# EAGLE design GimbalMotorController2017 (EAGLE 8.3.2)
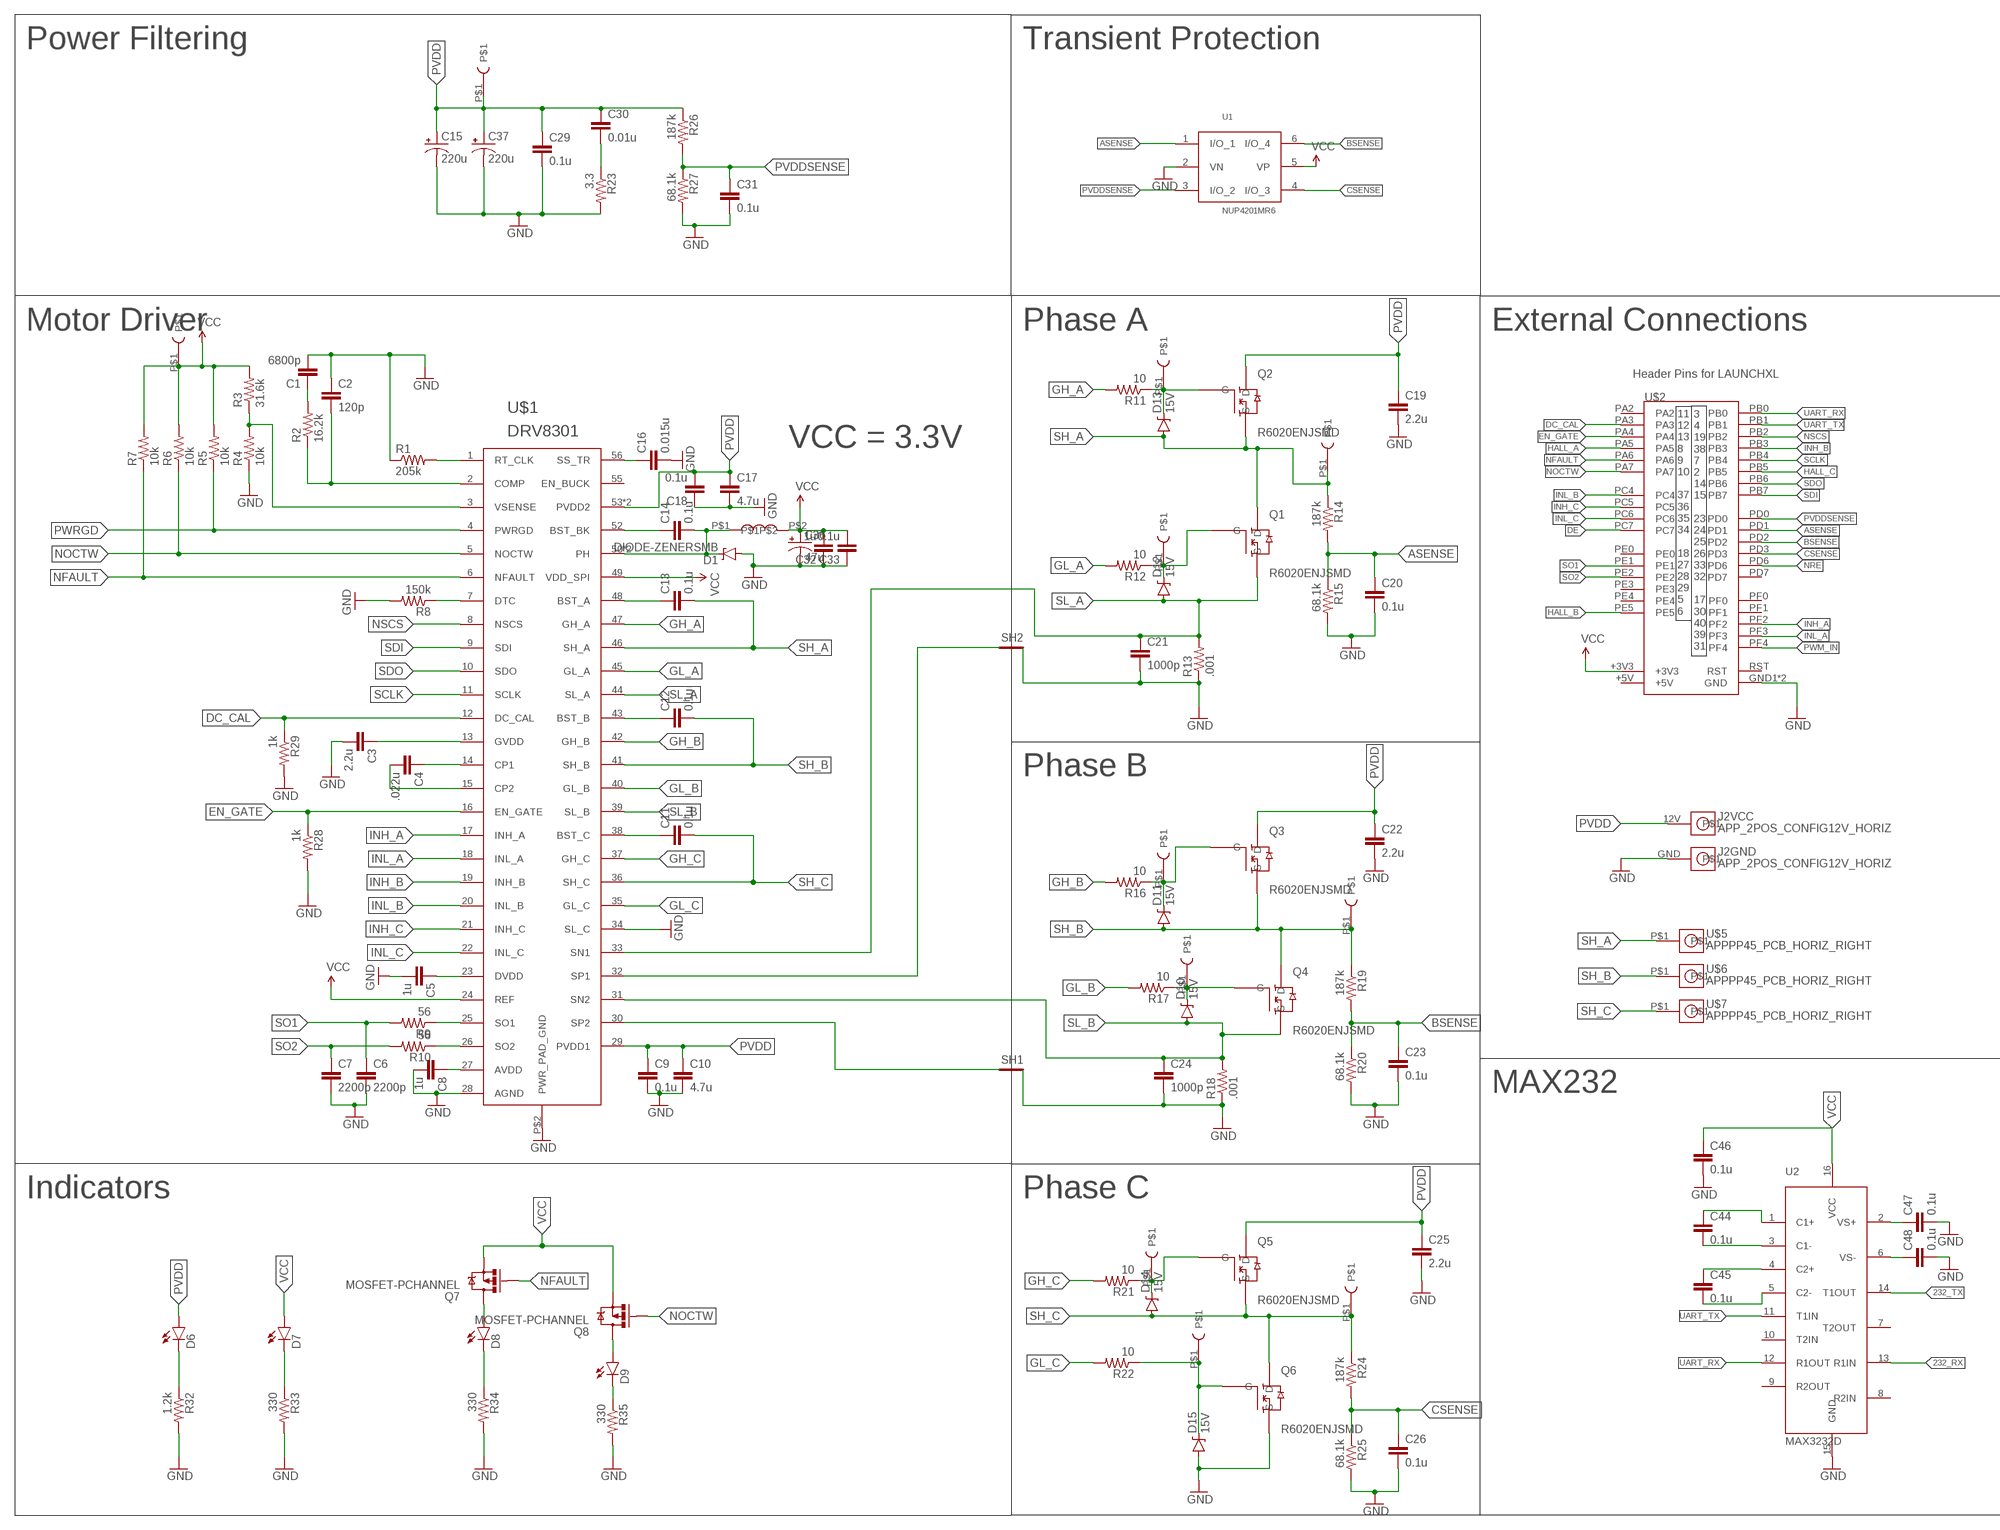
[diagram p0: schematic, sheet 1, part 1 of 2]
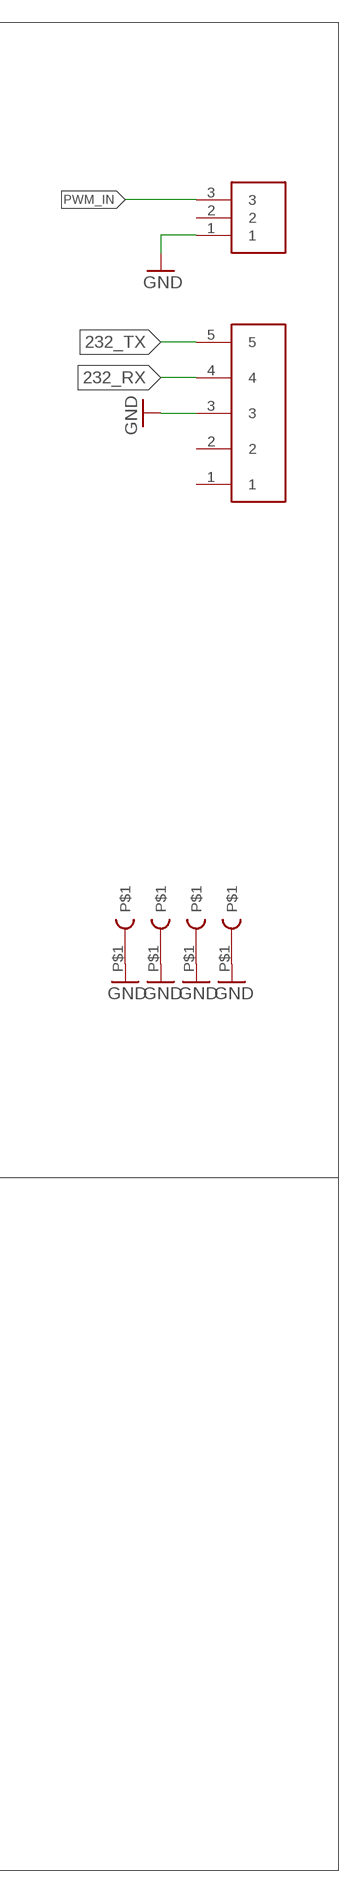
[diagram p1: schematic, sheet 1, part 2 of 2]

## Parts
C1  6800p  CAP0805  [0805]
C2  120p  CAP0805  [0805]
C3  2.2u  CAP1206  [1206]
C4  .022u  CAP0805  [0805]
C5  1u  CAP0805  [0805]
C6  2200p  CAP0805  [0805]
C7  2200p  CAP0805  [0805]
C8  1u  CAP0805  [0805]
C9  0.1u  CAP0805  [0805]
C10  4.7u  CAP1206  [1206]
C11  0.1u  CAP0805  [0805]
C12  0.1u  CAP0805  [0805]
C13  0.1u  CAP0805  [0805]
C14  0.1u  CAP0805  [0805]
C15  220u  CAP_POLPTH4  [CPOL-RADIAL-1000UF-25V]
C16  0.015u  CAP0805  [0805]
C17  4.7u  CAP1206  [1206]
C18  0.1u  CAP0805  [0805]
C19  2.2u  CAP1206  [1206]
C20  0.1u  CAP0805  [0805]
C21  1000p  CAP0805  [0805]
C22  2.2u  CAP1206  [1206]
C23  0.1u  CAP0805  [0805]
C24  1000p  CAP0805  [0805]
C25  2.2u  CAP1206  [1206]
C26  0.1u  CAP0805  [0805]
C29  0.1u  CAP0805  [0805]
C30  0.01u  CAP0805  [0805]
C31  0.1u  CAP0805  [0805]
C32  1u  CAP0805  [0805]
C33  0.1u  CAP0805  [0805]
C36  47u  CAP_POLPTH1  [CPOL-RADIAL-100UF-25V]
C37  220u  CAP_POLPTH4  [CPOL-RADIAL-1000UF-25V]
C44  0.1u  CAP0805  [0805]
C45  0.1u  CAP0805  [0805]
C46  0.1u  CAP0805  [0805]
C47  0.1u  CAP0805  [0805]
C48  0.1u  CAP0805  [0805]
D1  DIODE-ZENERSMB  [SMB-DIODE]
D6  LED1206  [LED-1206]
D7  LED1206  [LED-1206]
D8  LED1206  [LED-1206]
D9  LED1206  [LED-1206]
D10  15V  DIODE-ZENER3.3V  [SOD-323]
D11  15V  DIODE-ZENER3.3V  [SOD-323]
D12  15V  DIODE-ZENER3.3V  [SOD-323]
D13  15V  DIODE-ZENER3.3V  [SOD-323]
D14  15V  DIODE-ZENER3.3V  [SOD-323]
D15  15V  DIODE-ZENER3.3V  [SOD-323]
J1  SL03THROUGH_HOLE  [MOLEX_SL_03_TH]
J2  APP_2POS_CONFIG12V_HORIZ  [APP45_12V_HORIZ_CONFIG]
Q1  R6020ENJSMD  [D2PACK]
Q2  R6020ENJSMD  [D2PACK]
Q3  R6020ENJSMD  [D2PACK]
Q4  R6020ENJSMD  [D2PACK]
Q5  R6020ENJSMD  [D2PACK]
Q6  R6020ENJSMD  [D2PACK]
Q7  MOSFET-PCHANNEL  [SOT23-3]
Q8  MOSFET-PCHANNEL  [SOT23-3]
R1  205k  RESISTOR0805-RES  [0805]
R2  16.2k  RESISTOR0805-RES  [0805]
R3  31.6k  RESISTOR0805-RES  [0805]
R4  10k  RESISTOR0805-RES  [0805]
R5  10k  RESISTOR0805-RES  [0805]
R6  10k  RESISTOR0805-RES  [0805]
R7  10k  RESISTOR0805-RES  [0805]
R8  150k  RESISTOR0805-RES  [0805]
R9  56  RESISTOR0805-RES  [0805]
R10  56  RESISTOR0805-RES  [0805]
R11  10  RESISTOR0805-RES  [0805]
R12  10  RESISTOR0805-RES  [0805]
R13  .001  RESISTOR1206  [1206]
R14  187k  RESISTOR0805-RES  [0805]
R15  68.1k  RESISTOR0805-RES  [0805]
R16  10  RESISTOR0805-RES  [0805]
R17  10  RESISTOR0805-RES  [0805]
R18  .001  RESISTOR1206  [1206]
R19  187k  RESISTOR0805-RES  [0805]
R20  68.1k  RESISTOR0805-RES  [0805]
R21  10  RESISTOR0805-RES  [0805]
R22  10  RESISTOR0805-RES  [0805]
R23  3.3  RESISTOR0805-RES  [0805]
R24  187k  RESISTOR0805-RES  [0805]
R25  68.1k  RESISTOR0805-RES  [0805]
R26  187k  RESISTOR0805-RES  [0805]
R27  68.1k  RESISTOR0805-RES  [0805]
R28  1k  RESISTOR0805-RES  [0805]
R29  1k  RESISTOR0805-RES  [0805]
R32  1.2k  RESISTOR0805-RES  [0805]
R33  330  RESISTOR0805-RES  [0805]
R34  330  RESISTOR0805-RES  [0805]
R35  330  RESISTOR0805-RES  [0805]
SH1  SHORT-HT5  [SHORT_TOP-50]
SH2  SHORT-HT5  [SHORT_TOP-50]
U1  NUP4201MR6  [TSOP-6]
U2  MAX3232D  [SOIC16]
U$1  DRV8301  [TFSOP-56]
U$2  TIVA-C  [TIVA-C]
U$3  TEST_POINT_0.1INDIAM  [TEST_POINT_0.1INDIAM]
U$4  5PIN  [5PIN]
U$5  APPPP45_PCB_HORIZ_RIGHT  [APP45_PCB_HORIZ_RIGHT]
U$6  APPPP45_PCB_HORIZ_RIGHT  [APP45_PCB_HORIZ_RIGHT]
U$7  APPPP45_PCB_HORIZ_RIGHT  [APP45_PCB_HORIZ_RIGHT]
U$10  TEST_POINT_0.1INDIAM  [TEST_POINT_0.1INDIAM]
U$12  TEST_POINT_0.1INDIAM  [TEST_POINT_0.1INDIAM]
U$14  33u  INDUCTOR_DR74  [INDUCTOR_DR74]
U$15  TEST_POINT_0.1INDIAM  [TEST_POINT_0.1INDIAM]
U$16  TEST_POINT_0.1INDIAM  [TEST_POINT_0.1INDIAM]
U$17  TEST_POINT_0.1INDIAM  [TEST_POINT_0.1INDIAM]
U$18  TEST_POINT_0.1INDIAM  [TEST_POINT_0.1INDIAM]
U$19  TEST_POINT_0.1INDIAM  [TEST_POINT_0.1INDIAM]
U$20  TEST_POINT_0.1INDIAM  [TEST_POINT_0.1INDIAM]
U$24  TEST_POINT_0.1INDIAM  [TEST_POINT_0.1INDIAM]
U$25  TEST_POINT_0.1INDIAM  [TEST_POINT_0.1INDIAM]
U$26  TEST_POINT_0.1INDIAM  [TEST_POINT_0.1INDIAM]
U$27  TEST_POINT_0.1INDIAM  [TEST_POINT_0.1INDIAM]
U$28  TEST_POINT_0.1INDIAM  [TEST_POINT_0.1INDIAM]
U$29  TEST_POINT_0.1INDIAM  [TEST_POINT_0.1INDIAM]

## Nets
232_RX: U2.13(R1IN) U$4.4
232_TX: U2.14(T1OUT) U$4.5
ASENSE: C20.1 R14.2 R15.1 U1.1(I/O_1) U$2.PD1
BSENSE: C23.1 R19.2 R20.1 U1.6(I/O_4) U$2.PD2
CSENSE: C26.1 R24.2 R25.1 U1.4(I/O_3) U$2.PD3
DC_CAL: R29.1 U$1.12(DC_CAL) U$2.PA3
DE: U$2.PC7
EN_GATE: R28.1 U$1.16(EN_GATE) U$2.PA4
GH_A: R11.2 U$1.47(GH_A)
GH_B: R16.2 U$1.42(GH_B)
GH_C: R21.2 U$1.37(GH_C)
GL_A: R12.2 U$1.45(GL_A)
GL_B: R17.2 U$1.40(GL_B)
GL_C: R22.2 U$1.35(GL_C)
GND: C1.2 C2.1 C3.2 C5.2 C6.2 C7.2 C8.2 C9.2 C10.2 C15.2(-) C16.2 C17.2 C18.1 C19.2 C20.2 C21.2 C22.2 C23.2 C24.2 C25.2 C26.2 C29.2 C31.2 C32.1 C33.1 C36.2(-) C37.2(-) C46.2 C47.2 C48.2 D1.A D15.A J1.1 J2.GND Q6.2(S) R1.1 R4.1 R8.2 R13.1 R15.2 R18.1 R20.2 R23.2 R25.2 R27.2 R28.2 R29.2 R32.2 R33.2 R34.2 R35.2 SH1.2 SH2.2 U1.2(VN) U2.15(GND) U$1.28(AGND) U$1.34(SL_C) U$1.P$2(PWR_PAD_GND) U$2.GND1(GND) U$2.GND2(GND) U$4.3 U$26.P$1 U$27.P$1 U$28.P$1 U$29.P$1
HALL_A: U$2.PA5
HALL_B: U$2.PE5
HALL_C: U$2.PB5
INH_A: U$1.17(INH_A) U$2.PF2
INH_B: U$1.19(INH_B) U$2.PB3
INH_C: U$1.21(INH_C) U$2.PC5
INL_A: U$1.18(INL_A) U$2.PF3
INL_B: U$1.20(INL_B) U$2.PC4
INL_C: U$1.22(INL_C) U$2.PC6
N$1: C2.2 R2.1 U$1.2(COMP)
N$2: C1.1 R2.2
N$3: R3.1 R4.2 U$1.3(VSENSE)
N$4: R1.2 U$1.1(RT_CLK)
N$5: R8.1 U$1.7(DTC)
N$6: C4.1 U$1.14(CP1)
N$7: C4.2 U$1.15(CP2)
N$8: C3.1 U$1.13(GVDD)
N$9: C5.1 U$1.23(DVDD)
N$10: R9.1 U$1.25(SO1)
N$11: R10.1 U$1.26(SO2)
N$12: C8.1 U$1.27(AVDD)
N$13: D13.C Q2.1(G) R11.1 U$12.P$1
N$14: D11.C Q3.1(G) R16.1 U$16.P$1
N$15: D10.C Q4.1(G) R17.1 U$17.P$1
N$16: D12.C Q1.1(G) R12.1 U$15.P$1
N$17: D14.C Q5.1(G) R21.1 U$18.P$1
N$18: D15.C Q6.1(G) R22.1 U$19.P$1
N$21: C11.1 U$1.38(BST_C)
N$22: C30.2 R23.1
N$23: D6.C R32.1
N$24: D7.C R33.1
N$25: C12.1 U$1.43(BST_B)
N$26: D8.C R34.1
N$27: D9.C R35.1
N$28: D9.A Q8.3(D)
N$29: C13.1 U$1.48(BST_A)
N$30: C14.1 U$1.52(BST_BK)
N$31: C14.2 D1.C U$1.50(PH) U$1.51(PH) U$14.P$1
N$32: D8.A Q7.3(D)
N$35: C16.1 U$1.56(SS_TR)
N$40: C44.1 U2.1(C1+)
N$42: C44.2 U2.3(C1-)
N$43: C45.1 U2.4(C2+)
N$44: C45.2 U2.5(C2-)
N$45: C48.1 U2.6(VS-)
N$46: C47.1 U2.2(VS+)
NFAULT: Q7.1(G) R7.1 U$1.6(NFAULT) U$2.PA6
NOCTW: Q8.1(G) R6.1 U$1.5(NOCTW) U$2.PA7
NRE: U$2.PD6
NSCS: U$1.8(NSCS) U$2.PB2
PVDD: C9.1 C10.1 C15.1(+) C17.1 C18.2 C19.1 C22.1 C25.1 C29.1 C30.1 C37.1(+) D6.A J2.12V Q2.TAB(D) Q3.TAB(D) Q5.TAB(D) R26.1 U$1.29(PVDD1) U$1.53(PVDD2) U$1.54(PVDD2) U$3.P$1
PVDDSENSE: C31.1 R26.2 R27.1 U1.3(I/O_2) U$2.PD0
PWM_IN: J1.3 U$2.PF4
PWRGD: R5.1 U$1.4(PWRGD)
SCLK: U$1.11(SCLK) U$2.PB4
SDI: U$1.9(SDI) U$2.PB7
SDO: U$1.10(SDO) U$2.PB6
SH_A: C13.2 D13.A Q1.TAB(D) Q2.2(S) R14.1 U$1.46(SH_A) U$5.P$1 U$25.P$1
SH_B: C12.2 D11.A Q3.2(S) Q4.TAB(D) R19.1 U$1.41(SH_B) U$6.P$1 U$24.P$1
SH_C: C11.2 D14.A Q5.2(S) Q6.TAB(D) R24.1 U$1.36(SH_C) U$7.P$1 U$20.P$1
SL_A: C21.1 D12.A Q1.2(S) R13.2 U$1.33(SN1) U$1.44(SL_A)
SL_B: C24.1 D10.A Q4.2(S) R18.2 U$1.31(SN2) U$1.39(SL_B)
SO1: C6.1 R9.2 U$2.PE1
SO2: C7.1 R10.2 U$2.PE2
SP1: SH2.1 U$1.32(SP1)
SP2: SH1.1 U$1.30(SP2)
UART_RX: U2.12(R1OUT) U$2.PB0
UART_TX: U2.11(T1IN) U$2.PB1
VCC: C32.2 C33.2 C36.1(+) C46.1 D7.A Q7.2(S) Q8.2(S) R3.2 R5.2 R6.2 R7.2 U1.5(VP) U2.16(VCC) U$1.24(REF) U$1.49(VDD_SPI) U$2.+3V3 U$10.P$1 U$14.P$2
Unconnected: J1.2 U2.7(T2OUT) U2.8(R2IN) U2.9(R2OUT) U2.10(T2IN) U$1.55(EN_BUCK) U$2.PA2 U$2.PD7 U$2.PE0 U$2.PE3 U$2.PE4 U$2.PF0 U$2.PF1 U$4.1 U$4.2

## Notes on the sheet
- Power Filtering | Transient Protection
- Motor Driver | Phase A | External Connections
- Header Pins for LAUNCHXL
- VCC = 3.3V
- 11
  12
  13
  8
  9
  10
  
  37
  36
  35
  34
  
  18
  27
  28
  29
  5
  6
- 3
  4
  19
  38
  7
  2
  14
  15
  
  23
  24
  25
  26
  33
  32
  
  17
  30
  40
  39
  31
- Phase B
- MAX232
- Indicators | Phase C

## Power pins joined to a net without a drawn wire
+5V: U$2.+5V
RST: U$2.RST

## Library data of the parts
C1-C14 C16-C26 C29-C33 C44-C48 = SparkFun-Passives:CAP: Capacitor Standard 0603 ceramic capacitor, and 0.1" leaded capacitor.
C15 C36 C37 = SparkFun-Passives:CAP_POL: Capacitor Polarized These are standard SMD and PTH capacitors. Normally 10uF, 47uF, and 100uF in electrolytic and tantalum varieties. Always verify the external diameter of the through hole cap, it varies with capacity, voltage, and manufacturer. The EIA devices should be standard.
D1 = SparkFun-DiscreteSemi:DIODE-ZENER: Zener Diode Production Part - 8199 3.4V Zener Voltage
D6-D9 = SparkFun-LED:LED: LEDs Standard schematic elements and footprints for 5mm, 3mm, 1206, and 0603 sized LEDs. 5mm - Spark Fun Electronics SKU : COM-00529 (and others)
D10-D15 = SparkFun-DiscreteSemi:DIODE-ZENER: Zener Diode Production Part - 8199 3.4V Zener Voltage; PROD_ID: DIO-11284; VALUE: 3.3V
J1 = MRDT-Connectors:SL03: Molex 3-pin SL connector Locking 3 pin connector with standard header spacing. Backward compatible with standard RC servo connectors.; ORIENT: HORIZ; PARTNO: 0705550002
J2 = MRDT-Connectors:APP_2POS_CONFIG; COLOR1: YELLOW; COLOR2: BLACK
Q1-Q6 = R6020ENJTL ROHM D2PACK:R6020ENJ: 40V 195A N-CH MOSFET switch with heatsink
Q7 Q8 = SparkFun-DiscreteSemi:MOSFET-PCHANNEL: Generic PMOSFET IRLML2244 - TRANS-11153 (SOT-23 -20V -4.3A) (1.Gate 2.Source 3.Drain) FQP27P06 - COM-10349 <http://www.sparkfun.com/products/10349> (TO-220 -60V -27A) (1.Gate 2.Source 3.Drain); PROD_ID: TRANS-08285
R1-R29 R32-R35 = SparkFun-Passives:RESISTOR: Resistor Basic schematic elements and footprints for 0603, 1206, and PTH resistors.
SH1 SH2 = BLDC_Motor_Controller_2016_Rev1:SHORT-H: Short between two nets; BOM: no
U1 = MRDT-ICs:NUP4201MR6
U2 = MRDT-ICs:MAX*232; OPERATING_VOLTAGE: 3V3
U$1 = MRDT-ICs:DRV8301
U$2 = MRDT-2015-General:TIVA-C: TIVA-C DEV BOARD (NON-CONNECTED)
U$3 U$10 U$12 U$15-U$20 U$24-U$29 = MRDT-Connectors:TEST_POINT_0.1INDIAM
U$4 = Molex-SL:5PIN
U$5-U$7 = MRDT-Connectors:APP: http://www.powerwerx.com/anderson-powerpoles/
U$14 = Inductor_DR74:INDUCTOR_DR74

## Board
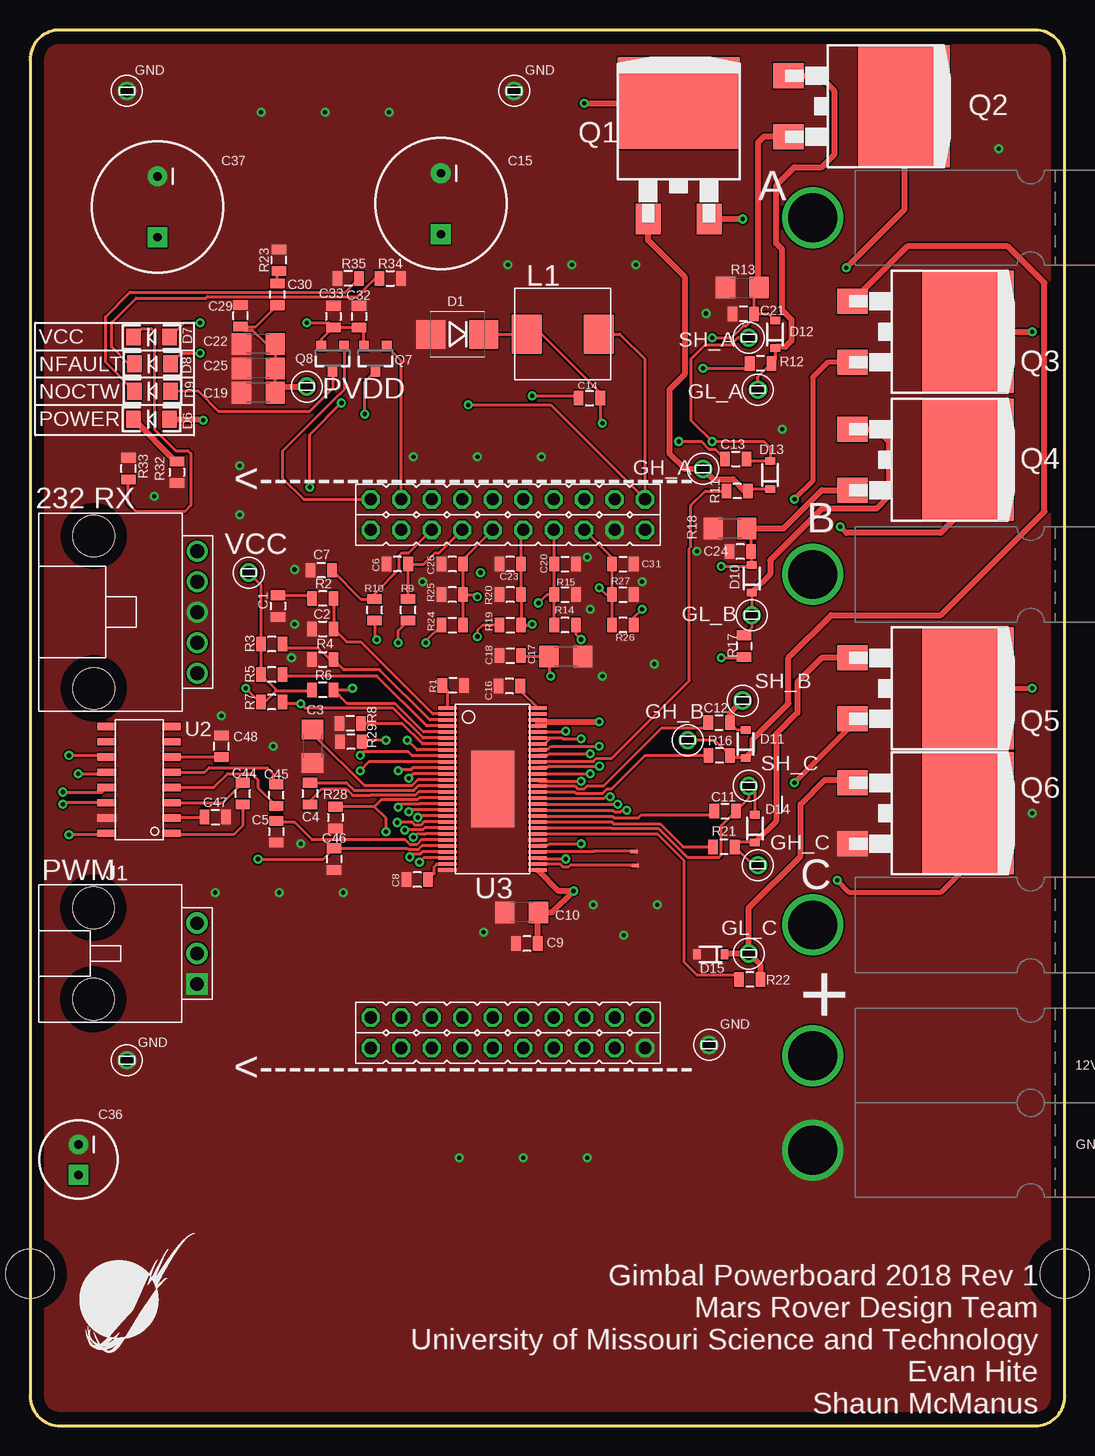
[diagram p2: board, top side]
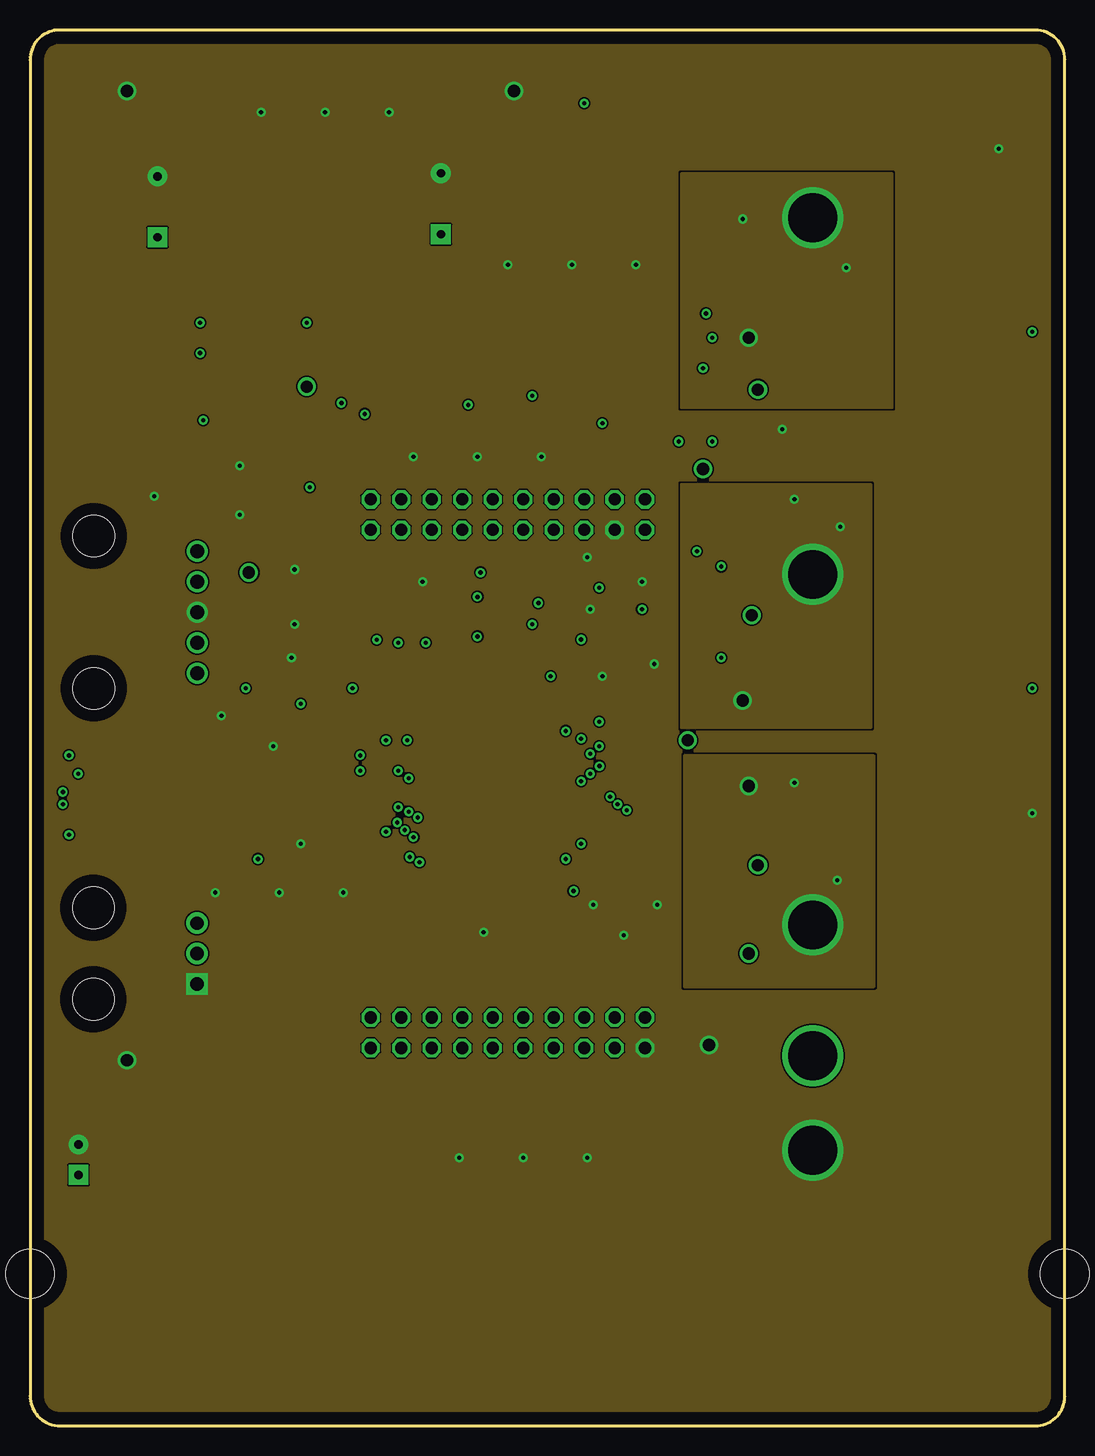
[diagram p3: board, inner layer UpperMid]
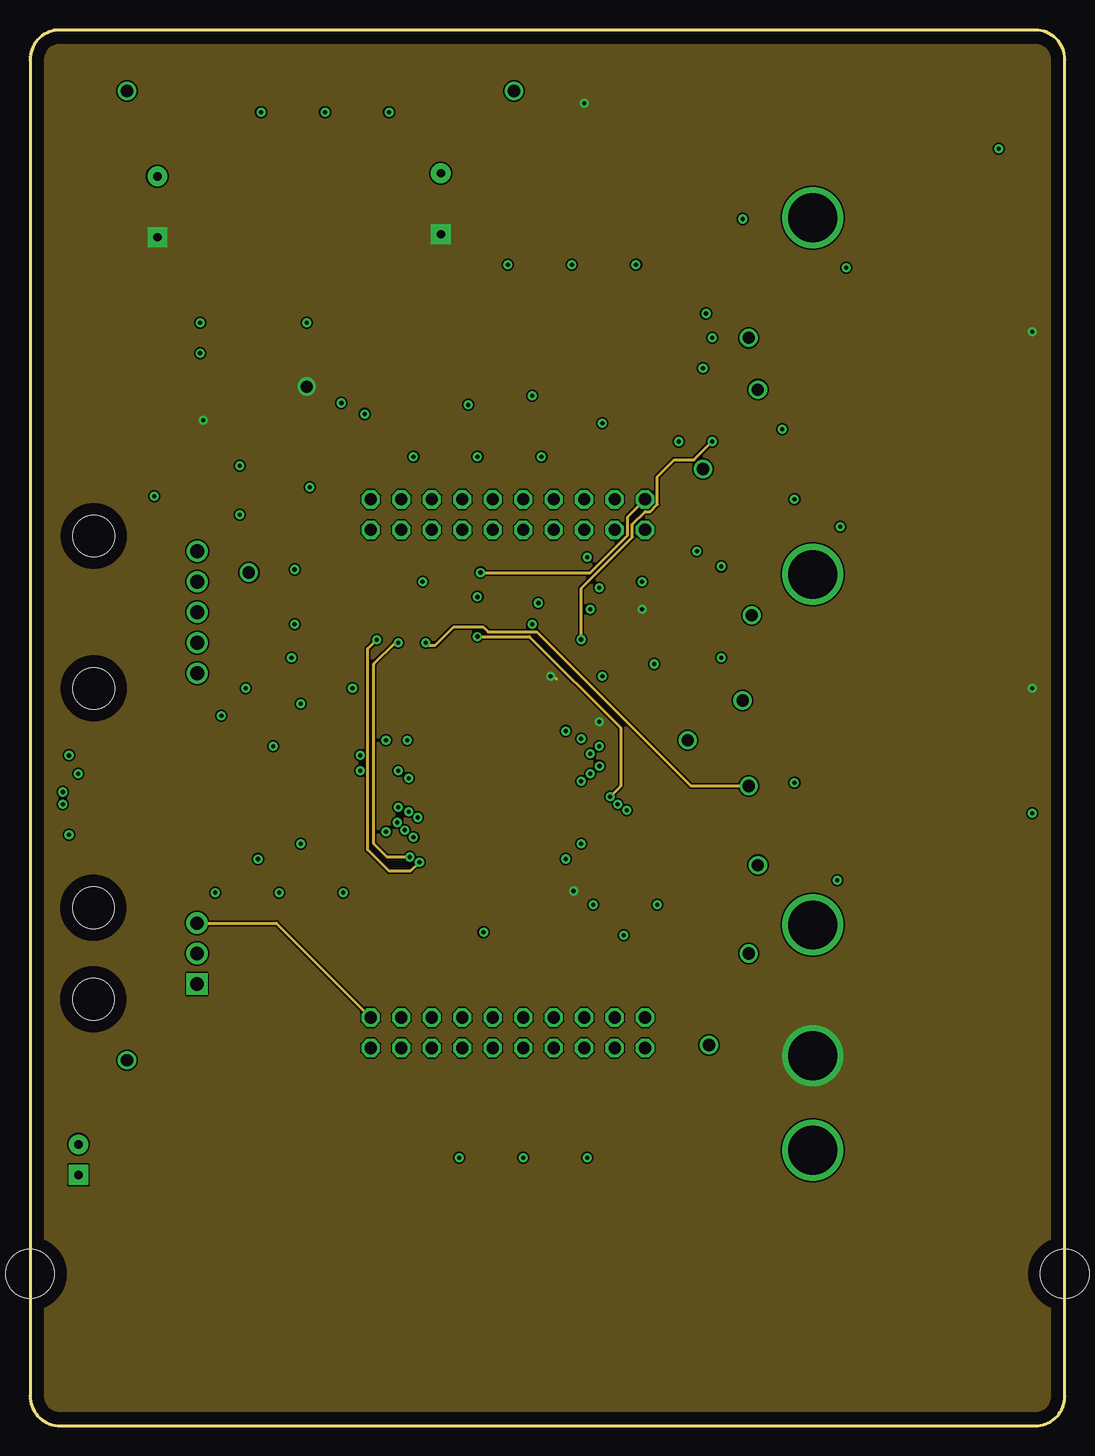
[diagram p4: board, inner layer LowerMid]
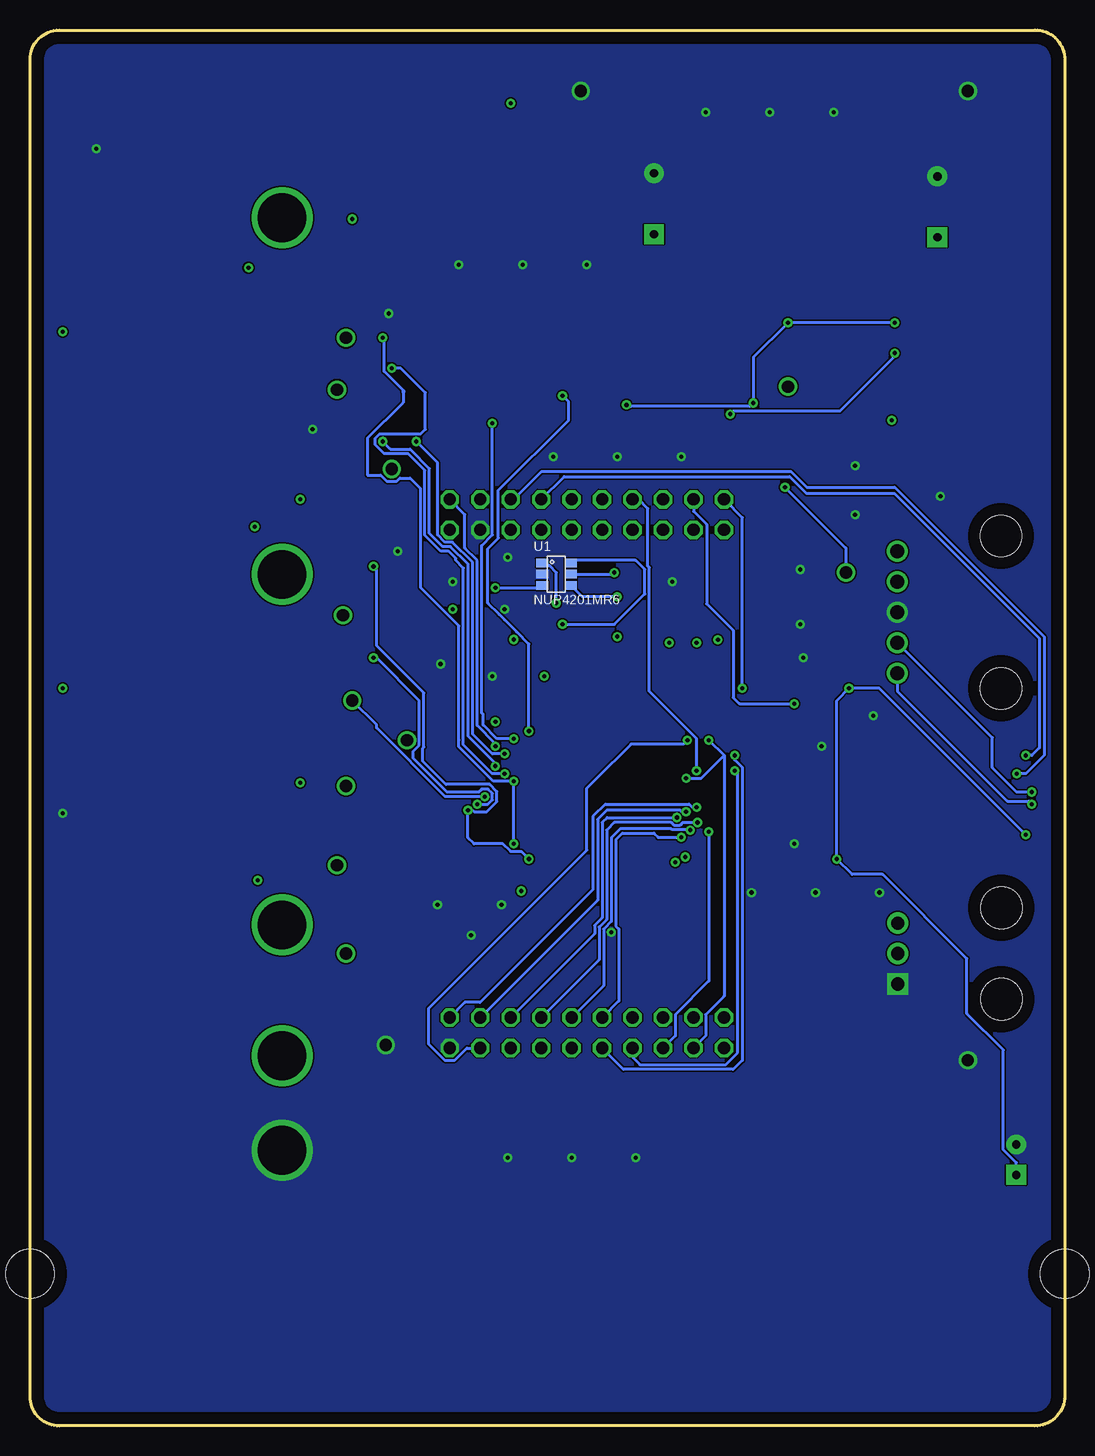
[diagram p5: board, bottom side, seen from below]

Size 86.23 x 116.33 mm. Coordinates in mm from the lower left corner, seen from the top.
Outline: 0,113.85 0,2.51 arc90 2.51,0 83.76,0 arc90 86.23,2.47 86.23,113.86 arc90 83.78,116.33 2.48,116.33 arc90 0,113.85
Copper layers (1*2*15*16): Top 0.035mm / dielectric 1.5mm / UpperMid 0.035mm / dielectric 0.15mm / LowerMid 0.035mm / dielectric 0.2mm / Bottom 0.035mm
Design rules "advanced_circuits_standard *": minimum track width 5mil, minimum drill 10mil, track to track 5mil, track to pad 5mil, pad to pad 5mil, via to via 5mil, smd to smd 5mil, copper to edge 40mil, drill to drill 5mil, minimum pad ring 10mil, minimum via ring 8mil, stop-mask expansion 4mil, vias tented up to drill 0mil, thermal gap 10mil
Holes 4.06 mm at 0,12.7 86.23,12.7

### Footprints (pad centres in the part's own frame; a part is rotated, then mirrored left to right if it is on the bottom)
0805 = smd 0.8 x 1.2: 1 -0.9,0; 2 0.9,0
1206 = smd 1.6 x 1.8: 1 -1.4,0; 2 1.4,0
CPOL-RADIAL-1000UF-25V = drill 0.7 pad 1.651 square: 1 2.54,0 | drill 0.7 pad 1.651: 2 -2.54,0
CPOL-RADIAL-100UF-25V = drill 0.7 pad 1.651 square: 1 1.27,0 | drill 0.7 pad 1.651: 2 -1.27,0
SMB-DIODE = smd 2.4 x 2.4: A 2.2,0; C -2.2,0
LED-1206 = smd 1.2 x 1.4: A -1.5,0; C 1.5,0
SOD-323 = smd 0.63 x 0.83: A 1.15,0; C -1.15,0
MOLEX_SL_03_TH = drill 1.092 pad 1.778 square: 1 -2.54,0 | drill 1.092 pad 1.778: 2 0,0; 3 2.54,0 | hole 3.454: -3.81,8.636; 3.81,8.636
APP45_12V_HORIZ_CONFIG = drill 4.064: 12V 28.194,3.937; GND 28.194,11.811
D2PACK = smd 2.083 x 2.54: 1 2.54,-3.048; 2 7.62,-3.048 | smd 10.16 x 7.62: TAB 5.08,6.604
SOT23-3 = smd 0.8 x 0.9: 1 -0.95,-1; 2 0.95,-1; 3 0,1.1
SHORT_TOP-50 = smd 0.305 x 0.305: 1 0.152,0; 2 -0.152,0
TSOP-6 = smd 0.991 x 0.711: 1 -1.194,0.94; 2 -1.194,0; 3 -1.194,-0.94; 4 1.194,-0.94; 5 1.194,0; 6 1.194,0.94
SOIC16 = smd 0.6 x 1.55: 1 -4.445,-2.7; 2 -3.175,-2.7; 3 -1.905,-2.7; 4 -0.635,-2.7; 5 0.635,-2.7; 6 1.905,-2.7; 7 3.175,-2.7; 8 4.445,-2.7; 9 4.445,2.7; 10 3.175,2.7; 11 1.905,2.7; 12 0.635,2.7; 13 -0.635,2.7; 14 -1.905,2.7; 15 -3.175,2.7; 16 -4.445,2.7
TFSOP-56 = smd 0.3 x 1.55: 1 -6.75,-3.75; 2 -6.25,-3.75; 3 -5.75,-3.75; 4 -5.25,-3.75; 5 -4.75,-3.75; 6 -4.25,-3.75; 7 -3.75,-3.75; 8 -3.25,-3.75; 9 -2.75,-3.75; 10 -2.25,-3.75; 11 -1.75,-3.75; 12 -1.25,-3.75; 13 -0.75,-3.75; 14 -0.25,-3.75; 15 0.25,-3.75; 16 0.75,-3.75; 17 1.25,-3.75; 18 1.75,-3.75; 19 2.25,-3.75; 20 2.75,-3.75; 21 3.25,-3.75; 22 3.75,-3.75; 23 4.25,-3.75; 24 4.75,-3.75; 25 5.25,-3.75; 26 5.75,-3.75; 27 6.25,-3.75; 28 6.75,-3.75; 29 6.75,3.75; 30 6.25,3.75; 31 5.75,3.75; 32 5.25,3.75; 33 4.75,3.75; 34 4.25,3.75; 35 3.75,3.75; 36 3.25,3.75; 37 2.75,3.75; 38 2.25,3.75; 39 1.75,3.75; 40 1.25,3.75; 41 0.75,3.75; 42 0.25,3.75; 43 -0.25,3.75; 44 -0.75,3.75; 45 -1.25,3.75; 46 -1.75,3.75; 47 -2.25,3.75; 48 -2.75,3.75; 49 -3.25,3.75; 50 -3.75,3.75; 51 -4.25,3.75; 52 -4.75,3.75; 53 -5.25,3.75; 54 -5.75,3.75; 55 -6.25,3.75; 56 -6.75,3.75 | smd 6.35 x 3.61: P$2 0,0
TIVA-C = drill 1.016 octagon: +3V3 30.48,2.54; +5V 30.48,5.08; GND1 33.02,5.08; GND2 30.48,48.26; PA2 53.34,48.26; PA3 50.8,48.26; PA4 48.26,48.26; PA5 48.26,2.54; PA6 50.8,2.54; PA7 53.34,2.54; PB0 35.56,2.54; PB1 38.1,2.54; PB2 33.02,48.26; PB3 35.56,45.72; PB4 45.72,2.54; PB5 33.02,2.54; PB6 45.72,48.26; PB7 43.18,48.26; PC4 38.1,45.72; PC5 40.64,45.72; PC6 43.18,45.72; PC7 45.72,45.72; PD0 35.56,5.08; PD1 38.1,5.08; PD2 40.64,5.08; PD3 43.18,5.08; PD6 48.26,45.72; PD7 50.8,45.72; PE0 35.56,48.26; PE1 45.72,5.08; PE2 48.26,5.08; PE3 50.8,5.08; PE4 40.64,2.54; PE5 43.18,2.54; PF0 38.1,48.26; PF1 53.34,5.08; PF2 30.48,45.72; PF3 33.02,45.72; PF4 53.34,45.72; RST 40.64,48.26
TEST_POINT_0.1INDIAM = drill 1.016: P$1 0,0
5PIN = drill 1.168: 1 5.08,0; 2 2.54,0; 3 0,0; 4 -2.54,0; 5 -5.08,0 | hole 3.454: -6.35,8.636; 6.35,8.636
APP45_PCB_HORIZ_RIGHT = drill 4.064: P$1 28.194,3.969
INDUCTOR_DR74 = smd 2.5 x 3.25: P$1 -3,0; P$2 3,0

### Placement (x,y rotation side)
C1  20.65,68.33 270 top
C2  24.4,66.42 0 top
C3  23.54,56.64 270 top
C4  23.32,52.7 270 top
C5  20.52,49.53 270 top
C6  30.62,71.82 180 top
C7  24.27,71.31 180 top
C8  32.27,45.53 180 top
C9  41.41,40.2 180 top
C10  40.97,42.8 180 top
C11  57.92,51.24 0 top
C12  57.42,58.61 0 top
C13  58.81,80.58 0 top
C14  46.62,85.66 0 top
C15  34.24,101.85 270 top
C16  39.95,61.66 180 top
C17  44.65,64.13 0 top
C18  40.02,64.2 0 top
C19  19.03,86.11 180 top
C20  44.59,71.82 0 top
C21  59.45,92.68 180 top
C22  19.03,90.17 180 top
C23  40.02,71.82 180 top
C24  59.19,72.87 180 top
C25  19.03,88.14 180 top
C26  35.19,71.82 180 top
C29  17.54,92.52 90 top
C30  20.62,94.3 90 top
C31  49.42,71.82 0 top
C32  27.41,92.46 270 top
C33  25.29,92.46 270 top
C36  4.04,22.19 270 top
C37  10.62,101.6 270 top
C44  17.73,52.7 90 top
C45  20.52,52.58 90 top
C46  25.35,47.24 270 top
C47  15.44,50.74 0 top
C48  15.95,56.64 90 top
D1  35.6,90.96 180 top
D6  10.14,83.88 180 top
D7  10.14,90.74 180 top
D8  10.2,88.52 180 top
D9  10.2,86.23 180 top
D10  60.15,70.61 90 top
D11  59.64,56.83 90 top
D12  62.1,90.97 90 top
D13  61.67,79.25 90 top
D14  60.4,49.78 90 top
D15  56.72,39.31 180 top
J1  13.92,39.37 90 top
J2  93.42,34.8 180 top
Q1  66.24,115.06 270 top
Q2  48.97,103.63 0 top
Q3  71.58,96.27 270 top
Q4  71.58,85.6 270 top
Q5  71.58,66.55 270 top
Q6  71.58,56.13 270 top
Q7  28.78,89 180 top
Q8  25.22,89 180 top
R1  35.26,61.72 180 top
R2  24.4,68.96 180 top
R3  20.14,65.15 180 top
R4  24.4,63.88 0 top
R5  20.14,62.61 180 top
R6  24.4,61.34 180 top
R7  20.14,60.33 180 top
R8  26.68,58.55 180 top
R9  31.51,68.01 90 top
R10  28.71,68.01 90 top
R11  58.94,77.91 180 top
R12  60.88,88.55 180 top
R13  59.35,94.87 0 top
R14  44.59,66.74 180 top
R15  44.59,69.28 0 top
R16  57.45,55.88 180 top
R17  59.51,64.99 270 top
R18  58.34,74.8 0 top
R19  40.02,66.74 0 top
R20  40.02,69.28 180 top
R21  57.83,48.26 180 top
R22  59.99,37.21 180 top
R23  20.75,97.16 90 top
R24  35.19,66.74 0 top
R25  35.19,69.28 180 top
R26  49.42,66.74 180 top
R27  49.42,69.28 0 top
R28  25.44,50.7 270 top
R29  26.75,57.02 180 top
R32  12.24,79.47 270 top
R33  8.2,79.79 90 top
R34  30.02,95.63 0 top
R35  26.52,95.63 180 top
SH1  50.44,46.71 180 top
SH2  50.34,47.88 180 top
U1  42.37,70.99 0 bottom
U2  9.09,53.85 90 top
U$1  38.56,53.09 270 top
U$2  81.74,79.76 180 top
U$3  23.06,86.61 0 top
U$4  13.95,67.82 90 top
U$5  93.42,104.65 180 top
U$6  93.42,74.93 180 top
U$7  93.42,45.72 180 top
U$9  [MRDT_LOGO]  4.11,5.26 0 top
U$10  18.24,71.12 0 top
U$12  56.08,79.76 0 top
U$14  44.4,91 0 top
U$15  60.66,86.36 0 top
U$16  54.81,57.15 0 top
U$17  60.15,67.56 0 top
U$18  60.66,46.74 0 top
U$19  59.89,39.37 0 top
U$20  59.89,53.34 0 top
U$24  59.39,60.45 0 top
U$25  59.89,90.68 0 top
U$26  8.08,30.48 0 top
U$27  56.59,31.75 0 top
U$28  40.34,111.25 0 top
U$29  8.08,111.25 0 top

### Tracks (layer width: path | path; a pad name or v marks a point on that pad's centre or on a via)
232_RX  (via drill 0.35)
  Top 0.254: v2.74,52.83 6.01,52.83 U2.13
  Bottom 0.254: v2.74,52.83 4.01,52.83 6.05,54.86 6.05,57.37 U$4.4
232_TX  (via drill 0.35)
  Top 0.254: U2.14 2.87,51.94 v2.74,51.82
  Bottom 0.254: U$4.5 13.95,61.25 4.78,52.07 3,52.07 v2.74,51.82
ASENSE  (via drill 0.35)
  Top 0.254: R14.2 R15.1 | R15.1 C20.1 43.69,74.62 U$2.PD1 | R15.1 43.07,69.28 v42.37,68.58
  Bottom 0.254: U1.1 43.31,71.68 42.93,71.68 42.37,71.12 v42.37,68.58
BSENSE  (via drill 0.35)
  Top 0.254: v41.86,66.8 41.8,66.74 R19.2 R20.1 C23.1 40.92,74.5 U$2.PD2
  Bottom 0.254: v41.86,66.8 37.54,66.8 35,69.34 35,71.37 35.76,72.14 40.97,72.14 U1.6
CSENSE  (via drill 0.35)
  Top 0.254: R24.2 R25.1 | R25.1 C26.1 36.09,72.21 U$2.PD3 | R25.1 37.1,69.28 v37.29,69.09
  Bottom 0.254: v37.29,69.09 40.21,69.09 U1.4
DC_CAL  (via drill 0.35)
  Top 0.254: U$1.12 31.95,54.34 31.92,54.3 31.88,54.3 v31.56,53.98 | v29.67,57.15 27.77,57.15 R29.1
  Bottom 0.254: v29.67,57.15 28.4,55.88 | v31.56,53.98 31.21,53.98 31.2,53.98 30.29,53.98 28.4,55.88 | U$2.PA3 29.92,32.51 29.92,34.29 28.4,35.81 28.4,55.88
EN_GATE  (via drill 0.35)
  Top 0.254: U$1.16 32.42,52.34 32.3,52.21 29.3,52.21 28.69,51.61 | 28.69,51.61 R28.1 | v29.67,49.53 29.67,50.63 28.69,51.61
  Bottom 0.254: U$2.PA4 32.46,32.51 32.46,34.29 29.67,37.08 v29.67,49.53
GH_A
  Top 0.254: U$1.47 42.35,55.38 46.95,55.38 47.2,55.63 48.46,55.63 54.94,62.11 54.94,73.16 55.07,73.28 55.07,76.71 56.27,77.91 R11.2
GH_B
  Top 0.254: U$1.42 45.38,52.84 45.51,52.71 47.71,52.71 48.09,53.09 48.46,53.09 51.26,55.88 R16.2
GH_C
  Top 0.254: U$1.37 48.48,50.34 48.64,50.18 52.52,50.18 54.44,48.26 R21.2
GL_A  (via drill 0.35)
  Top 0.254: U$1.45 42.33,54.36 v46.69,54.36 | v56.08,88.14 59.57,88.14 R12.2
  Bottom 0.254: v46.69,54.36 47.72,54.36 50.11,56.75 50.11,71.5 50.75,72.14 50.75,72.3 51.35,72.9 51.99,72.9 53.32,74.23 53.32,79.63 53.39,79.69 | v56.08,88.14 55.32,88.14 53.29,86.11 53.29,83.06 53.67,82.67 57.11,82.67 57.48,82.3 57.48,81.78 56.72,81.02 54.72,81.02 53.39,79.69 | 53.39,79.69
GL_B  (via drill 0.35)
  Top 0.254: v48.97,51.82 48.61,51.82 48.6,51.81 42.33,51.81 U$1.40 | v57.61,64.01 59.43,64.01 R17.2
  Bottom 0.254: v48.97,51.82 48.96,51.81 48.08,51.81 47.71,52.18 47.71,52.71 48.08,53.08 48.6,53.08 48.83,52.85 51.5,52.85 54.29,55.64 54.29,56.24 53.8,56.73 53.8,60.45 57.35,64.01 v57.61,64.01
GL_C
  Top 0.254: U$1.35 52.28,49.34 54.47,47.15 54.47,38.7 55.58,37.59 58.71,37.59 R22.2
GND  (via drill 0.35)
  other vias: 10.36,77.47 22.05,66.8 55.58,72.9 56.34,92.71 47.7,62.48 32.72,70.36 46.43,72.39 46.69,68.07 51,70.36 22.05,71.37 21.79,64.01 15.95,59.18 22.56,48.51 37.8,41.15 19.25,109.47 24.59,109.47 29.92,109.47 31.95,80.77 37.29,80.77 42.62,80.77 39.83,96.77 45.16,96.77 50.5,96.77 46.94,43.43 52.27,43.43 49.48,40.89 15.44,44.45 20.78,44.45 26.11,44.45 17.48,80.01 20.27,56.64 83.52,51.05 52.02,63.5 17.48,75.95 35.76,22.35 41.1,22.35 46.43,22.35 62.69,83.06 80.72,106.43
  pour Top (rank 3, no thermals): -32.56,130.56 124.92,130.56 124.92,-2.54 -32.56,-2.54
  pour Bottom (rank 2, no thermals): -41.45,125.98 126.19,125.98 125.68,-8.38 -41.96,-8.38
  pour UpperMid (rank 2, no thermals): -37.13,128.02 130,128.02 129.74,-4.57 -37.39,-4.57
INH_A  (via drill 0.35)
  Top 0.254: U$1.17 32.46,51.84 32.46,51.83 30.95,51.83 v30.68,51.56
  Bottom 0.254: v30.68,51.56 31.04,51.56 31.31,51.83 38.29,51.83 39.32,50.8 39.32,44.7 48.72,35.31 49.99,35.31 U$2.PF2
INH_B  (via drill 0.35)
  Top 0.254: U$1.19 32.46,50.84 v32.32,50.7
  Bottom 0.254: v32.32,50.7 38.15,50.7 38.56,50.29 38.56,42.36 39.19,41.73 39.19,41.02 U$2.PB3
INH_C  (via drill 0.35)
  Top 0.254: U$1.21 32.89,49.84 32.74,49.69 31.26,49.69 v31.22,49.66
  Bottom 0.254: v31.22,49.66 31.26,49.69 32.74,49.69 32.84,49.78 37.03,49.78 37.8,49.02 37.8,42.04 38.43,41.41 38.43,36.71 U$2.PC5
INL_A  (via drill 0.35)
  Top 0.254: U$1.18 31.71,51.34 v31.57,51.2
  Bottom 0.254: v31.57,51.2 31.92,51.2 32.06,51.34 38.15,51.34 38.94,50.55 38.94,43.81 U$2.PF3
INL_B  (via drill 0.35)
  Top 0.254: U$1.20 32.85,50.34 32.58,50.07 32.06,50.07 31.84,50.29 v30.61,50.29
  Bottom 0.254: v30.61,50.29 31.84,50.29 32.06,50.07 32.58,50.07 32.81,50.29 37.54,50.29 38.18,49.66 38.18,42.2 38.81,41.57 38.81,38.87 U$2.PC4
INL_C  (via drill 0.35)
  Top 0.254: U$1.22 32.93,49.34 32.9,49.31 32.2,49.31 v31.95,49.06
  Bottom 0.254: v31.95,49.06 33.89,49.06 34.24,49.4 36.88,49.4 37.41,48.86 37.41,41.66 37.16,41.41 37.16,35.43 U$2.PC6
N$1
  Top 0.254: U$1.2 33.58,59.34 29.41,63.5 27.57,65.34 26.38,65.34 C2.2 R2.1
N$2
  Top 0.254: C1.1 23.23,69.23 R2.2
N$3
  Top 0.254: R3.1 21.38,64.81 24.03,64.81 24.96,63.88 R4.2 26.16,63.02 29.13,63.02 29.15,62.99 29.16,62.99 33.32,58.84 U$1.3
N$4
  Top 0.254: U$1.1 34.81,61.27 R1.2
N$5
  Top 0.254: 34.3,56.84 U$1.7 32.71,56.84 31.03,58.52 27.87,58.52 27.71,58.67 R8.1
N$6
  Top 0.254: U$1.14 32.35,53.34 31.98,52.97 27,52.97 26.37,53.61 C4.1
N$7
  Top 0.254: U$1.15 32.38,52.84 32.14,52.59 28.42,52.59 28.41,52.58 26.87,52.58 26.86,52.59 26.84,52.59 26.35,53.09 24.33,53.09 23.32,52.07 C4.2
N$8
  Top 0.254: U$1.13 32.31,53.84 31.82,53.35 27.88,53.35 23.83,57.4 23.83,57.76 C3.1
N$9
  Top 0.254: U$1.23 32.63,48.84 32.22,48.43 31.69,48.43 31.28,48.84 23.5,48.84 22.05,50.29 20.66,50.29 C5.1
N$10  (via drill 0.35)
  Top 0.254: U$1.25 32.7,47.84 32.53,47.66 31.89,47.66 v31.63,47.41 | v30.68,65.28 30.68,66.28 R9.1
  LowerMid 0.254: v31.63,47.41 29.75,47.41 28.65,48.51 28.65,63.5 30.43,65.28 v30.68,65.28
N$11  (via drill 0.35)
  Top 0.254: U$1.26 32.81,47.34 v32.46,46.99 | R10.1 28.72,65.72 v28.91,65.53
  LowerMid 0.254: v32.46,46.99 31.7,46.23 29.92,46.23 28.14,48.01 28.14,64.77 v28.91,65.53
N$12
  Top 0.254: U$1.27 34.79,46.82 33.9,46.82 33.7,46.62 33.7,46.06 C8.1
N$13
  Top 0.254: D13.C 60.02,78.1 R11.1
  Top 0.508: Q2.1 51.51,98.81 54.56,95.76 54.56,87.63 53.29,86.36 53.29,81.03 54.56,79.76 U$12.P$1 56.94,78.9 58.6,78.9 59.58,77.91 R11.1
N$14
  Top 0.254: D11.C 58.55,55.68 R16.1 57.08,57.15 U$16.P$1
  Top 0.508: D11.C 60.22,56.26 60.22,57.22 63.2,60.2 63.2,64.01 66.75,67.56 75.9,67.56 84.53,76.2 84.53,95.25 81.48,98.3 73.1,98.3 Q3.1
N$15
  Top 0.254: D10.C U$17.P$1 60.15,66.53 R17.1
  Top 0.508: Q4.1 70.56,83.06 71.58,82.04 71.58,77.47 70.56,76.45 65.99,76.45 61.67,72.14 61.67,70.99 D10.C
N$16
  Top 0.254: D12.C 62.1,89.9 | D12.C 62.1,88.87 R12.1 60.66,87.43 U$15.P$1 | 62.19,89.92 D12.C
  Top 0.508: Q1.1 65.74,112.52 67.01,111.25 67.01,105.92 65.99,104.9 63.7,104.9 62.18,103.38 62.18,98.55 62.69,98.04 62.69,92.96 63.45,92.2 63.45,90.42 62.94,89.92 62.19,89.92
N$17
  Top 0.254: D14.C 59.1,48.63 R21.1 60.25,46.74 U$18.P$1
  Top 0.508: Q5.1 65.99,64.01 63.96,61.98 63.96,59.44 62.18,57.66 62.18,50.41 D14.C
N$18
  Top 0.254: 57.93,39.37 D15.C | 68.28,53.85 Q6.1
  Top 0.508: R22.1 60.89,38.38 U$19.P$1 | U$19.P$1 57.93,39.37 | U$19.P$1 59.89,43.18 64.21,47.5 64.21,51.82 66.24,53.85 68.28,53.85
N$21
  Top 0.254: U$1.38 42.33,50.81 48.54,50.81 48.68,50.68 50.71,50.68 50.96,50.93 56.71,50.93 C11.1
N$22
  Top 0.254: C30.2 20.62,96.13 R23.1
N$23
  Top 0.254: R32.1 12.15,80.37
  Top 0.508: 12.15,80.37 D6.C
N$24
  Top 0.254: D7.C 9.34,91.44 10.11,91.44 10.36,91.19 10.36,83.06 12.14,81.28 13.16,81.28 13.41,81.03 13.41,76.71 12.9,76.2 8.84,76.2 8.2,76.84 R33.1
N$25
  Top 0.254: U$1.43 45.42,53.34 45.66,53.1 46.19,53.1 46.43,53.34 47.8,53.34 52.63,58.17 56.52,58.17 C12.1
N$26
  Top 0.254: 8.58,88.65 D8.C 8.2,88.52 6.81,89.92 6.81,91.95 8.84,93.98 14.68,93.98 14.81,94.11 27.26,94.11 28.78,95.63 R34.1
N$27
  Top 0.254: R35.1 26.28,94.49 8.33,94.49 6.3,92.46 6.3,88.65 D9.C
N$28
  Top 0.254: D9.A 14.05,86.23 15.7,84.58 23.32,84.58 25.22,86.49 Q8.3
N$29  (via drill 0.35)
  Top 0.254: U$1.48 42.4,55.93 43.19,55.93 43.27,56.01 v46.69,56.01 | 57.72,80.77 C13.1 57.09,81.41 56.58,81.41 55.95,82.04 v54.05,82.04
  Bottom 0.254: v46.69,56.01 47.71,56.01 49.35,57.65 49.35,71.97 51.03,73.66 51.68,73.66 52.27,74.25 52.27,80.26 v54.05,82.04
N$30  (via drill 0.35)
  Top 0.254: 45.71,85.7 45.66,85.85 | 45.71,85.7 C14.1 | v41.86,85.85 45.55,85.85 45.71,85.7 | U$1.52 44.58,57.84 v44.65,57.91
  Bottom 0.254: 47.13,67.62 46.69,67.18 | 47.13,67.62 48.08,68.57 48.08,73.11 47.19,74 47.19,77.98 41.35,83.82 41.35,85.34 v41.86,85.85 | 47.13,67.62 45.68,66.17 45.66,66.17 44.65,65.16 v44.65,57.91
N$31  (via drill 0.35)
  Top 0.254: 47.52,86.11 C14.2 47.52,83.75 v47.7,83.57 | 47.7,85.93 47.52,86.11 | 47.52,86.11 42.63,91 U$14.P$1 41.37,90.96 D1.C | U$1.51 43.38,57.34 | 43.38,57.34 42.88,56.84 U$1.50 | 43.38,57.34 44.34,57.34 44.39,57.28 v45.92,57.28 v45.92,57.27
  Bottom 0.254: v47.7,83.57 47.7,74.25 48.59,73.37 48.59,59.44 48.46,59.31 48.46,58.42 47.32,57.27 v45.92,57.27
N$32  (via drill 0.35)
  Top 0.254: D8.A 12.59,89.41 v14.17,89.41 | v27.89,84.33 27.89,87.01 Q7.3
  Bottom 0.254: 26.08,84.58 18.75,84.58 14.17,89.15 v14.17,89.41 | 26.08,84.58 | v27.89,84.33 27.64,84.58 26.08,84.58
N$35
  Top 0.254: C16.1 40.85,61.29 U$1.56
N$40
  Top 0.254: C44.1 17.73,50.04 16.97,49.28 11.92,49.28 U2.1
N$42
  Top 0.254: U2.3 16.07,51.94 C44.2
N$43
  Top 0.254: U2.4 15.32,53.21 16.46,54.36 18.49,54.36 19,53.85 19,53.2 C45.1
N$44
  Top 0.254: U2.5 14.55,54.48 14.94,54.86 19.76,54.86 20.27,54.36 20.27,53.73 C45.2
N$45
  Top 0.254: U2.6 C48.1
N$46
  Top 0.254: U2.2 11.86,50.74 C47.1
NFAULT  (via drill 0.35)
  Top 0.254: R7.1 21.17,60.2 v22.56,60.2 22.95,59.8 30.29,59.8 32.75,57.34 U$1.6 | Q7.1 30.94,88.79 U$2.PA6
  Bottom 0.254: U$2.PA6 30.94,76.22 29.85,75.13 29.85,68.5 27.64,66.29 27.64,60.71 27.13,60.2 v22.56,60.2
NOCTW  (via drill 0.35)
  Top 0.254: U$1.5 32.79,57.84 30.43,60.2 26.44,60.2 R6.1 26.75,61.34 v26.87,61.47 | 25.37,85.56 21.03,81.22 21.03,78.99 22.81,77.22 U$2.PA7 | Q8.1 26.17,86.37 25.37,85.56 | 25.37,85.56
  Bottom 0.254: v26.87,61.47 26.87,75.69 U$2.PA7
NSCS  (via drill 0.35)
  Top 0.254: U$1.8 32.26,56.34 v31.45,57.15
  Bottom 0.254: v31.45,57.15 31.77,56.83 36.15,56.83 39.1,53.88 | 39.1,53.88 39.32,53.66 | U$2.PB2 49.82,31.5 50.84,30.48 51.68,30.48 53.04,31.84 53.04,34.77 39.83,47.98 39.83,53.15 39.1,53.88
PVDD  (via drill 0.35)
  Top 0.254: 42.31,42.74 C10.1 42.88,43.3 | 43.19,64.2 C17.1 | R26.1 50.32,67.38 v51,68.07 | 17.6,91.56 C29.1 | 17.6,91.56 17.83,91.32 18.54,91.32 19.69,90.17 C22.1 C25.1 C19.1 20.94,86.61 | 17.6,91.56 18.78,91.56 C30.1 20.69,93.47 | C18.2 40.98,64.13 C17.1 | C17.1 43.25,62.61 v43.38,62.48 | U$1.53 42.34,58.37 | U$1.54 42.47,58.67 | U$1.29 42.34,46.3
  Top 0.406: Q5.TAB v83.52,61.47
  Top 0.508: Q3.TAB v83.52,91.19 | v46.18,110.24 Q2.TAB | 20.94,86.61 U$3.P$1 | C10.1 43.52,42.8 v45.3,44.58 44.06,44.58 42.34,46.3 | C9.1 42.31,42.74 | v47.45,58.67 42.47,58.67 42.34,58.8 42.34,58.37 | v14.43,83.82 14.36,83.88 D6.A
  LowerMid 0.254: v43.38,62.48 43.64,62.48 43.89,62.23
  pour LowerMid (rank 2, no thermals): -44.25,132.08 133.3,132.08 134.32,-6.86 -43.23,-6.86
PVDDSENSE  (via drill 0.35)
  Top 0.254: R27.1 C31.1 48.52,72.34 U$2.PD0 | R26.2 R27.1 | R27.1 48.02,69.28 v47.45,69.85
  Bottom 0.254: v47.45,69.85 43.76,69.85 U1.3
PWM_IN
  LowerMid 0.254: J1.3 20.52,41.91 U$2.PF4
PWRGD
  Top 0.254: U$1.4 33.05,58.34 28.91,62.48 21.17,62.48 R5.1
SCLK  (via drill 0.35)
  Top 0.254: U$1.11 31.91,54.84 31.76,54.68 30.75,54.68 v30.69,54.61
  Bottom 0.254: U$2.PB4 35.51,77.22 34.75,76.45 34.75,71.66 34.62,71.53 34.62,61.22 30.69,57.29 v30.69,54.61
SDI  (via drill 0.35)
  Top 0.254: U$1.9 31.87,55.84 31.51,56.2 28.18,56.2 28.15,56.17 27.8,56.17 v27.51,55.88
  Bottom 0.254: v27.51,55.88 27.51,55.51 26.88,54.87 26.88,30.47 27.64,29.72 36.78,29.72 U$2.PB7
SDO  (via drill 0.35)
  Top 0.254: U$1.10 31.52,55.34 | 31.52,55.34 31.5,55.31 | 31.52,55.34 28.24,55.34 v27.51,54.61
  Bottom 0.254: U$2.PB6 36.02,30.73 35.38,30.1 28.27,30.1 27.26,31.11 27.26,54.36 v27.51,54.61
SH_A  (via drill 0.35)
  Top 0.254: C13.2 59.9,80.4 D13.A 61.67,81.53 61.16,82.04 v56.85,82.04 55.07,83.82 55.07,88.9 56.21,90.05 58.36,90.05 59,90.68 U$25.P$1 | U$1.46 42.4,54.93 43.19,54.93 43.25,54.99 v47.46,54.99 | R14.1 45.49,65.97 v45.92,65.54
  Top 0.508: Q1.TAB 72.85,101.35 v68.02,96.52 | Q2.2 v59.39,100.58
  LowerMid 0.254: v45.92,65.54 45.92,69.8 50.19,74.07 50.19,75.13 51.26,76.2 51.68,76.2 52.27,76.8 52.27,79.12 53.67,80.51 55.31,80.51 v56.85,82.04
  Bottom 0.254: v47.46,54.99 47.46,55.22 49.73,57.49 49.73,71.82 51.19,73.28 51.84,73.28 52.94,74.38 52.94,79.78 54.56,81.41 56.21,81.41 | 56.21,81.4 56.21,81.41 | 56.21,81.41 v56.85,82.04
  pour UpperMid (no thermals): 54.31,104.39 71.83,104.39 71.83,84.84 54.31,84.84
SH_B  (via drill 0.35)
  Top 0.254: D11.A 58.95,57.98 C12.2 | v48.34,52.45 47.99,52.45 47.87,52.33 42.51,52.33 42.5,52.34 U$1.41 | R19.1 37.73,66.74 37.29,66.29 v37.29,65.79
  Top 0.406: Q4.TAB 78.18,76.71 | 68.02,74.42 v67.51,74.93 | Q3.2 66.5,88.65 65.23,87.38 65.23,78.74 v63.7,77.22
  Top 0.508: C12.2 58.32,59.38 U$24.P$1 | 78.18,76.71 75.9,74.42 68.02,74.42
  LowerMid 0.254: v37.29,65.79 41.61,65.79 49.23,58.17 49.23,53.33 v48.34,52.45
  Bottom 0.254: v48.34,52.45 48.7,52.45 51.64,52.45 57.35,58.17 57.35,58.42 U$24.P$1
  pour UpperMid (no thermals): 70.05,58.17 54.31,58.17 54.31,78.49 70.05,78.49
SH_C  (via drill 0.35)
  Top 0.254: D14.A 60.4,52.83 U$20.P$1 59.89,52.31 C11.2 57.58,50 57.58,47.55 57.43,47.41 54.75,47.41 52.36,49.8 48.48,49.8 48.44,49.84 U$1.36 | v32.97,65.28 32.97,65.42 R24.1
  Top 0.406: Q6.TAB 78.18,46.74 75.9,44.45 68.28,44.45 v67.26,45.47 | Q5.2 68.53,58.42 v63.7,53.59
  LowerMid 0.254: U$20.P$1 55.07,53.34 42.24,66.17 38.17,66.17 37.8,66.55 35.26,66.55 33.73,65.02 33.22,65.02 v32.97,65.28
  pour UpperMid (no thermals): 70.31,36.58 54.56,36.58 54.56,55.88 70.31,55.88
SL_A  (via drill 0.35)
  Top 0.254: 60.66,92.68 61.54,92.68 D12.A | 60.66,92.68 C21.1 60.35,94.46 R13.2 60.66,94.97 | U$1.44 42.4,53.74 43.19,53.74 43.2,53.73 v45.92,53.73 | U$1.33 42.4,48.43 43.19,48.43 43.27,48.51 v45.92,48.51 | 60.66,92.68 59.67,91.69 59.47,91.69 58.46,90.68 v56.85,90.68
  Top 0.508: Q1.2 61.16,107.44 60.66,106.93 60.66,94.97
  Bottom 0.254: v45.92,48.51 v45.92,53.73 47.63,53.73 50.49,56.6 50.49,57.15 50.5,57.15 50.5,66.67 53.7,69.88 53.7,78.14 54.56,78.99 55.41,78.99 55.66,78.74 56.5,78.74 57.01,79.25 58.12,79.25 58.12,82.3 55.13,85.28 55.13,86.11 | 55.13,86.29 55.07,86.23 55.07,86.17 55.13,86.11 | 55.13,86.29 56.72,87.88 56.72,90.55 v56.85,90.68 | 55.13,86.11 55.13,86.29
SL_B  (via drill 0.35)
  Top 0.254: 59.75,74.79 R18.2 | 59.75,74.79 60.1,74.45 C24.1 60.15,72.81 D10.A 60.21,71.69 60.15,71.63 v57.61,71.63 | U$1.39 42.34,51.31 48.59,51.31 48.7,51.19 49.23,51.19 49.35,51.31 v49.73,51.31 | U$1.31 42.39,47.25 v44.65,47.25 | 68.28,77.98 Q4.2 | 59.89,74.93 59.75,74.79
  Top 0.508: R18.2 62.81,74.8 65.99,77.98 68.28,77.98
  Bottom 0.254: v57.61,71.63 57.35,71.37 57.35,65.02 53.42,61.09 53.42,56.57 53.51,56.48 53.51,55.4 51.57,53.46 47.92,53.46 47.33,52.87 47.33,52.03 48.17,51.19 49.23,51.19 49.35,51.31 v49.73,51.31 49.73,49.02 49.23,48.51 46.82,48.51 46.19,47.88 45.29,47.88 v44.65,47.25
SO1
  Top 0.254: R9.2 C6.1 32.83,71.82 33.76,72.75 34.09,72.75 U$2.PE1
SO2
  Top 0.254: C7.1 27.57,68.91 R10.2 28.72,69.35 30.79,71.42 30.79,72.56 30.98,72.75 31.55,72.75 U$2.PE2
SP1
  Top 0.254: U$1.32 42.35,47.88 46.94,47.88 | 46.94,47.88 47.03,47.88 | 49.99,47.88 46.94,47.88 | 49.99,47.88 50.08,47.88 | SH2.1 49.99,47.88
SP2
  Top 0.254: U$1.30 44.17,46.84 44.39,46.62 44.92,46.62 45.01,46.71 49.99,46.71 | 49.99,46.71 50.08,46.71 | SH1.1 49.99,46.71
UART_RX  (via drill 0.35)
  Top 0.254: v4.01,54.36 6.27,54.36 U2.12
  Bottom 0.254: U$2.PB0 45.92,77.22 43.64,79.5 22.78,79.5 21.52,78.25 14.19,78.25 1.73,65.79 1.73,55.88 2.62,54.99 | 2.62,54.99 2.45,55.16 | 2.62,54.99 3.25,54.36 v4.01,54.36
UART_TX  (via drill 0.35)
  Top 0.254: v3.25,55.88 6.27,55.88 U2.11
  Bottom 0.254: U$2.PB1 41.73,79.12 22.94,79.12 21.68,77.87 | 21.68,77.87 | 21.68,77.87 21.54,77.72 14.2,77.72 2.12,65.64 2.12,56.5 2.74,55.88 v3.25,55.88
VCC  (via drill 0.35)
  Top 0.254: 20.51,61.26 19.58,60.33 R7.2 19.13,60.33 v17.98,61.47 18.11,61.59 | R6.2 23.41,61.26 20.51,61.26 | 20.51,61.26 20.51,61.35 R5.2 R3.2 19.24,70.12 U$10.P$1 18.32,71.2 | 34.75,48.32 34.77,48.34 U$1.24 32.66,48.34 32.37,48.05 31.53,48.05 31.44,48.14 C46.1 24.45,47.24 v19,47.24 | D7.A 12.85,91.95 v14.17,91.95 | U$1.49 42.4,56.43 43.19,56.43 43.4,56.64 v47.45,56.64 | 6.39,49.18 U2.16 6.27,49.28 v3.25,49.28 | U$14.P$2 49.16,91 51.26,88.9 U$2.+3V3 43.38,85.09 v36.53,85.09 | Q7.2 27.83,91.14 C32.2 C33.2 | Q8.2 24.27,90.54 C33.2 | v23.06,91.95 24.89,91.95 C33.2 | v25.95,85.25 23.32,82.62 v23.32,78.23
  LowerMid 0.254: U$2.+3V3 49.81,75.77 49.81,74.22 46.71,71.12 v37.54,71.12
  Bottom 0.254: U1.5 37.67,70.99 v37.54,71.12 | v14.17,91.95 v23.06,91.95 25.95,89.06 v25.95,85.25 26.24,84.96 36.15,84.96 36.4,85.21 v36.53,85.09 | v23.32,78.23 18.24,73.15 U$10.P$1 | v47.45,56.64 47.45,56.86 48.97,58.39 48.97,72.13 49.99,73.15 49.99,75.95 U$2.+3V3 | v3.25,49.28 15.44,61.47 v17.98,61.47 19,60.45 v19,47.24 17.73,45.97 15.19,45.97 8.15,38.94 8.15,34.37 5.12,31.34 5.12,23.02 4.05,21.94 C36.1

### Text on the board
tPlace: GND | GND | Q2 | Q1 | A | L1 | VCC | SH_A | NFAULT | Q3 | NOCTW | PVDD | GL_A | POWER | <------------------------------ | GH_A | Q4 | 232 RX | B | VCC | GL_B | SH_B | GH_B | Q5 | SH_C | Q6 | GH_C | PWM | C | U3 | GL_C | + | GND | GND | <------------------------------ | Gimbal Powerboard 2018 Rev 1 / Mars Rover Design Team / University of Missouri Science and Technology / Evan Hite / Shaun McManus